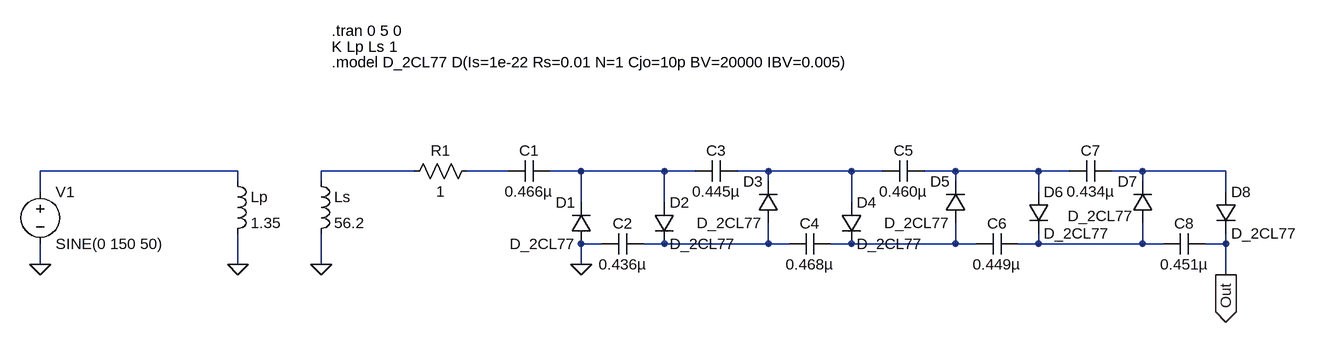
[diagram p0: schematic CCF1.asc]
CCF1.asc, the LTspice schematic file:
Version 4.1
SHEET 1 1428 680
WIRE -224 80 -528 80
WIRE 48 80 -96 80
WIRE 192 80 128 80
WIRE 304 80 256 80
WIRE 432 80 304 80
WIRE 480 80 432 80
WIRE 592 80 544 80
WIRE 720 80 592 80
WIRE 768 80 720 80
WIRE 880 80 832 80
WIRE 1008 80 880 80
WIRE 1056 80 1008 80
WIRE 1168 80 1120 80
WIRE 1296 80 1168 80
WIRE -224 96 -224 80
WIRE -96 96 -96 80
WIRE 592 96 592 80
WIRE 880 96 880 80
WIRE 1168 96 1168 80
WIRE -528 112 -528 80
WIRE 1008 112 1008 80
WIRE 1296 112 1296 80
WIRE 304 128 304 80
WIRE 432 128 432 80
WIRE 720 128 720 80
WIRE 336 192 304 192
WIRE 432 192 400 192
WIRE 592 192 592 160
WIRE 592 192 432 192
WIRE 624 192 592 192
WIRE 720 192 688 192
WIRE 880 192 880 160
WIRE 880 192 720 192
WIRE 912 192 880 192
WIRE 1008 192 1008 176
WIRE 1008 192 976 192
WIRE 1168 192 1168 160
WIRE 1168 192 1008 192
WIRE 1200 192 1168 192
WIRE 1296 192 1296 176
WIRE 1296 192 1264 192
WIRE -528 224 -528 192
WIRE -224 224 -224 176
WIRE -96 224 -96 176
WIRE 304 224 304 192
WIRE 1296 240 1296 192
FLAG -96 224 0
FLAG -224 224 0
FLAG -528 224 0
FLAG 304 224 0
FLAG 1296 240 Out
IOPIN 1296 240 Out
SYMBOL cap 256 64 R90
WINDOW 0 0 32 VBottom 2
WINDOW 3 32 32 VTop 2
SYMATTR InstName C1
SYMATTR Value 0.466µ
SYMATTR SpiceLine V=3K Irms=0 Rser=0.0236 Lser=663p
SYMBOL res 144 64 R90
WINDOW 0 0 56 VBottom 2
WINDOW 3 32 56 VTop 2
SYMATTR InstName R1
SYMATTR Value 1
SYMBOL ind -112 80 R0
SYMATTR InstName Ls
SYMATTR Value 56.2
SYMATTR Type ind
SYMATTR SpiceLine Ipk=1.4 Rser=207.5 Rpar=16970 Cpar=1.698p
SYMBOL ind -240 80 R0
SYMATTR InstName Lp
SYMATTR Value 1.35
SYMATTR Type ind
SYMATTR SpiceLine Ipk=6.9 Rser=3.1 Rpar=0 Cpar=0
SYMBOL diode 320 192 R180
WINDOW 0 24 64 Left 2
WINDOW 3 24 0 Left 2
SYMATTR InstName D1
SYMATTR Value D_2CL77
SYMBOL voltage -528 96 R0
WINDOW 123 0 0 Left 0
WINDOW 39 24 124 Left 2
SYMATTR InstName V1
SYMATTR Value SINE(0 150 50)
SYMBOL cap 400 176 R90
WINDOW 0 0 32 VBottom 2
WINDOW 3 32 32 VTop 2
SYMATTR InstName C2
SYMATTR Value 0.436µ
SYMATTR SpiceLine V=3K Irms=0 Rser=0.0236 Lser=663p
SYMBOL diode 416 128 R0
SYMATTR InstName D2
SYMATTR Value D_2CL77
SYMBOL cap 544 64 R90
WINDOW 0 0 32 VBottom 2
WINDOW 3 32 32 VTop 2
SYMATTR InstName C3
SYMATTR Value 0.445µ
SYMATTR SpiceLine V=3K Irms=0 Rser=0.0236 Lser=663p
SYMBOL diode 608 160 R180
WINDOW 0 24 64 Left 2
WINDOW 3 24 0 Left 2
SYMATTR InstName D3
SYMATTR Value D_2CL77
SYMBOL cap 688 176 R90
WINDOW 0 0 32 VBottom 2
WINDOW 3 32 32 VTop 2
SYMATTR InstName C4
SYMATTR Value 0.468µ
SYMATTR SpiceLine V=3K Irms=0 Rser=0.0236 Lser=663p
SYMBOL diode 704 128 R0
SYMATTR InstName D4
SYMATTR Value D_2CL77
SYMBOL cap 832 64 R90
WINDOW 0 0 32 VBottom 2
WINDOW 3 32 32 VTop 2
SYMATTR InstName C5
SYMATTR Value 0.460µ
SYMATTR SpiceLine V=3K Irms=0 Rser=0.0236 Lser=663p
SYMBOL diode 896 160 R180
WINDOW 0 24 64 Left 2
WINDOW 3 24 0 Left 2
SYMATTR InstName D5
SYMATTR Value D_2CL77
SYMBOL cap 976 176 R90
WINDOW 0 0 32 VBottom 2
WINDOW 3 32 32 VTop 2
SYMATTR InstName C6
SYMATTR Value 0.449µ
SYMATTR SpiceLine V=3K Irms=0 Rser=0.0236 Lser=663p
SYMBOL diode 992 112 R0
SYMATTR InstName D6
SYMATTR Value D_2CL77
SYMBOL cap 1120 64 R90
WINDOW 0 0 32 VBottom 2
WINDOW 3 32 32 VTop 2
SYMATTR InstName C7
SYMATTR Value 0.434µ
SYMATTR SpiceLine V=3K Irms=0 Rser=0.0236 Lser=663p
SYMBOL diode 1184 160 R180
WINDOW 0 24 64 Left 2
WINDOW 3 29 11 Left 2
SYMATTR InstName D7
SYMATTR Value D_2CL77
SYMBOL cap 1264 176 R90
WINDOW 0 0 32 VBottom 2
WINDOW 3 32 32 VTop 2
SYMATTR InstName C8
SYMATTR Value 0.451µ
SYMATTR SpiceLine V=3K Irms=0 Rser=0.0236 Lser=663p
SYMBOL diode 1280 112 R0
SYMATTR InstName D8
SYMATTR Value D_2CL77
TEXT -80 -112 Left 2 !K Lp Ls 1
TEXT -80 -88 Left 2 !.model D_2CL77 D(Is=1e-22 Rs=0.01 N=1 Cjo=10p BV=20000 IBV=0.005)
TEXT -80 -136 Left 2 !.tran 0 5 0

The netlist it stands for:
* CCF1.asc
C1 N004 N003 0.466µ V=3K Irms=0 Rser=0.0236 Lser=663p
R1 N003 N002 1
Ls N002 0 56.2 Ipk=1.4 Rser=207.5 Rpar=16970 Cpar=1.698p
Lp N001 0 1.35 Ipk=6.9 Rser=3.1 Rpar=0 Cpar=0
D1 0 N004 D_2CL77
V1 N001 0 SINE(0 150 50)
C2 N008 0 0.436µ V=3K Irms=0 Rser=0.0236 Lser=663p
D2 N004 N008 D_2CL77
C3 N005 N004 0.445µ V=3K Irms=0 Rser=0.0236 Lser=663p
D3 N008 N005 D_2CL77
C4 N009 N008 0.468µ V=3K Irms=0 Rser=0.0236 Lser=663p
D4 N005 N009 D_2CL77
C5 N006 N005 0.460µ V=3K Irms=0 Rser=0.0236 Lser=663p
D5 N009 N006 D_2CL77
C6 N010 N009 0.449µ V=3K Irms=0 Rser=0.0236 Lser=663p
D6 N006 N010 D_2CL77
C7 N007 N006 0.434µ V=3K Irms=0 Rser=0.0236 Lser=663p
D7 N010 N007 D_2CL77
C8 Out N010 0.451µ V=3K Irms=0 Rser=0.0236 Lser=663p
D8 N007 Out D_2CL77
.model D D
.lib standard.dio
K Lp Ls 1
.model D_2CL77 D(Is=1e-22 Rs=0.01 N=1 Cjo=10p BV=20000 IBV=0.005)
.tran 0 5 0
.backanno
.end